# EAGLE schematic Teensy_Board_Connectors (EAGLE 7.1.0)
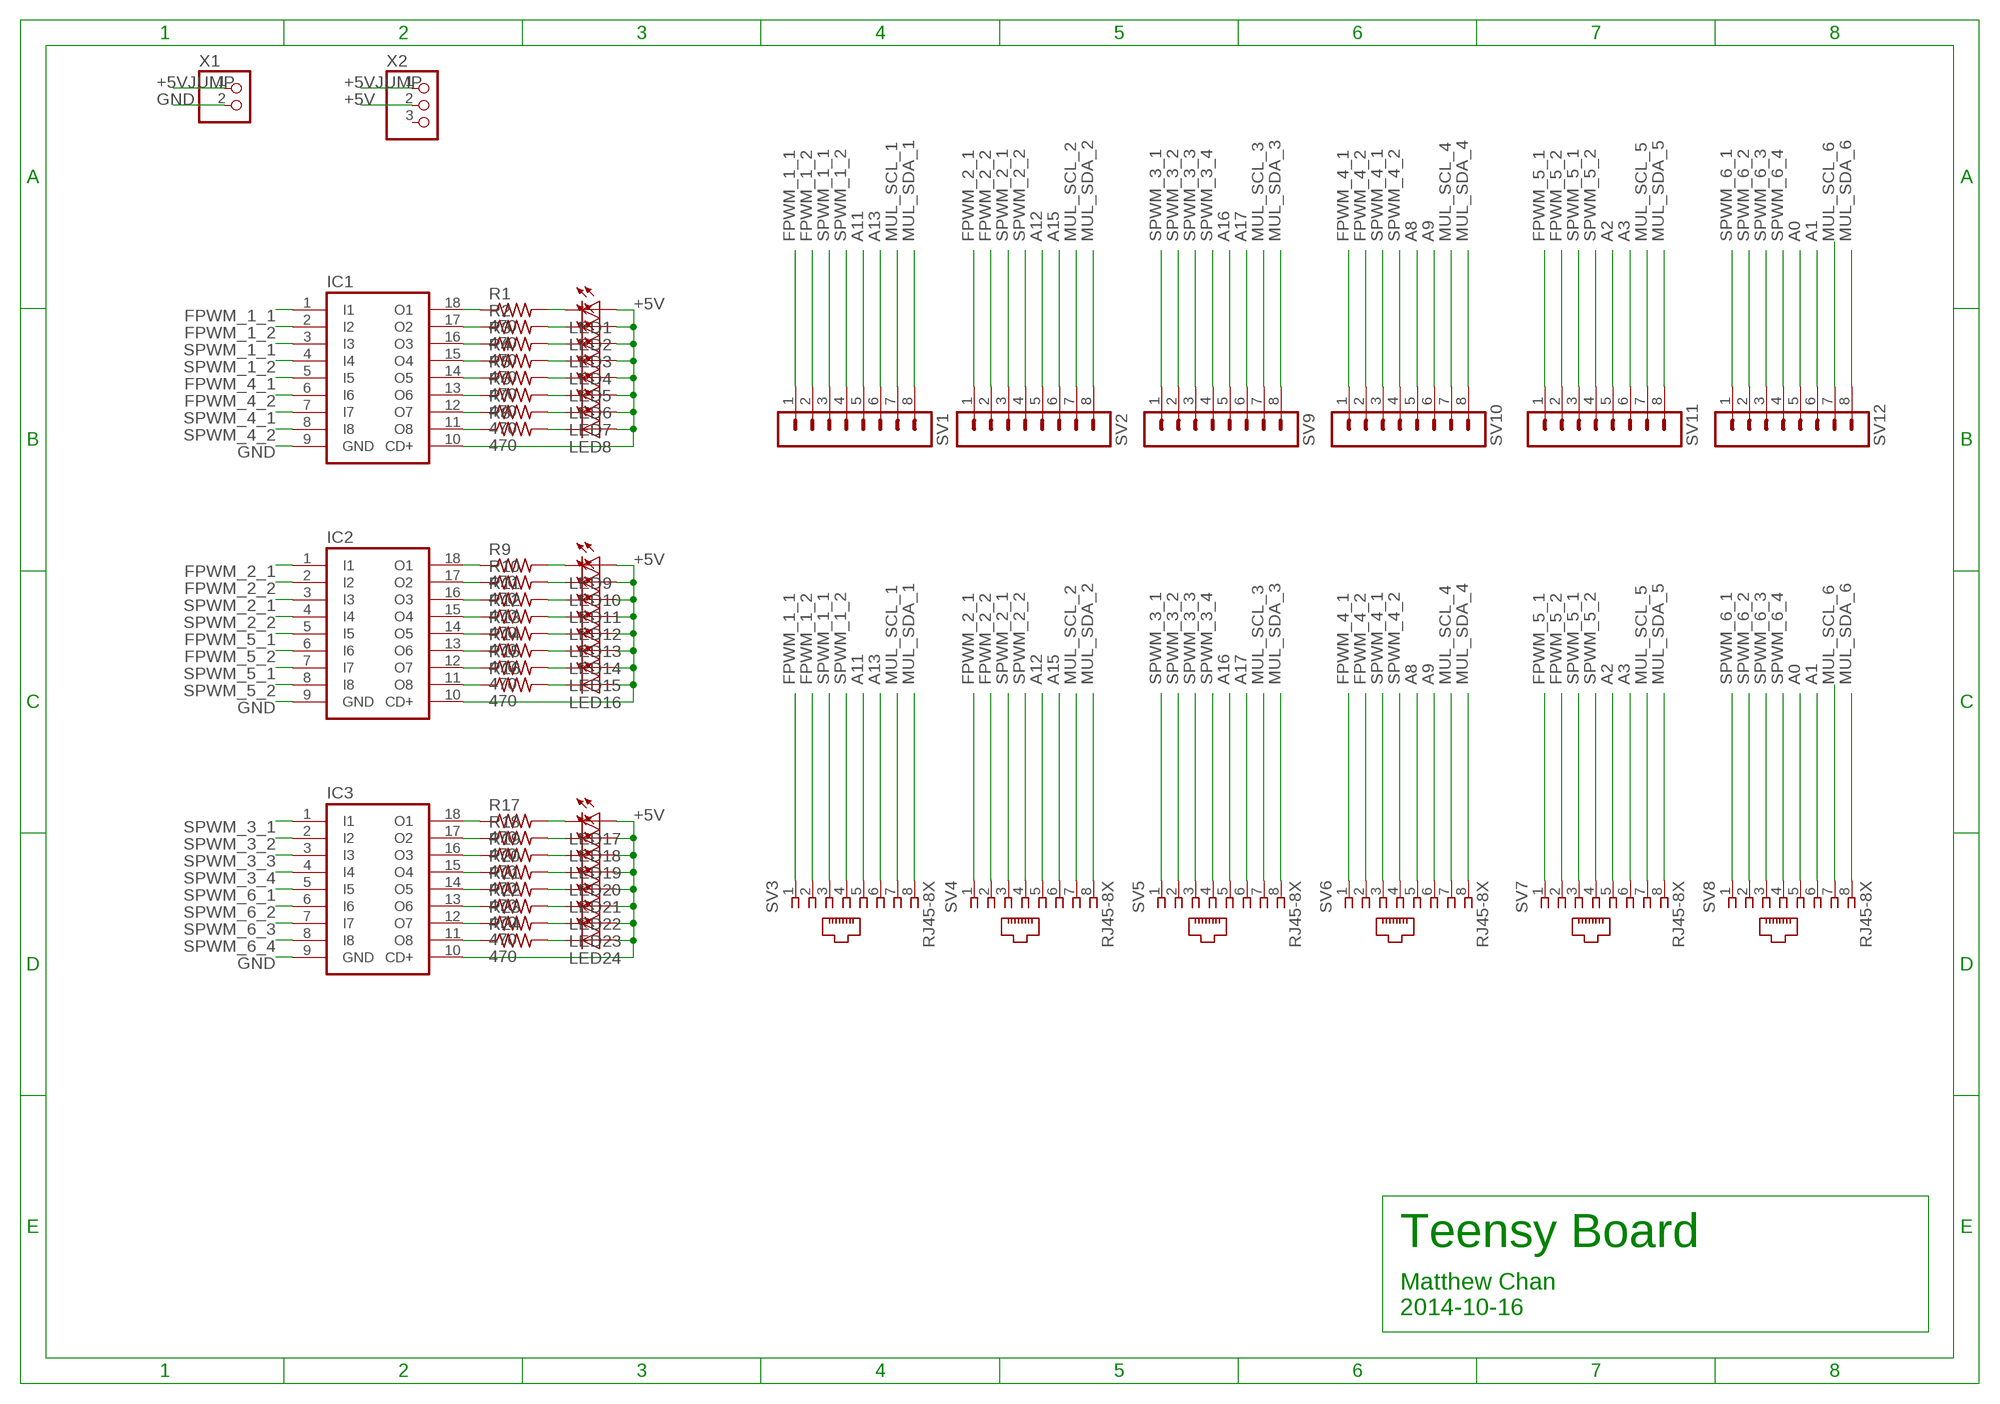
[diagram p0: schematic, sheet 1]

## Parts
IC1  ULN2803AFWG  [SOP18]
IC2  ULN2803AFWG  [SOP18]
IC3  ULN2803AFWG  [SOP18]
LED1  LEDSML1206  [SML1206]
LED2  LEDSML1206  [SML1206]
LED3  LEDSML1206  [SML1206]
LED4  LEDSML1206  [SML1206]
LED5  LEDSML1206  [SML1206]
LED6  LEDSML1206  [SML1206]
LED7  LEDSML1206  [SML1206]
LED8  LEDSML1206  [SML1206]
LED9  LEDSML1206  [SML1206]
LED10  LEDSML1206  [SML1206]
LED11  LEDSML1206  [SML1206]
LED12  LEDSML1206  [SML1206]
LED13  LEDSML1206  [SML1206]
LED14  LEDSML1206  [SML1206]
LED15  LEDSML1206  [SML1206]
LED16  LEDSML1206  [SML1206]
LED17  LEDSML1206  [SML1206]
LED18  LEDSML1206  [SML1206]
LED19  LEDSML1206  [SML1206]
LED20  LEDSML1206  [SML1206]
LED21  LEDSML1206  [SML1206]
LED22  LEDSML1206  [SML1206]
LED23  LEDSML1206  [SML1206]
LED24  LEDSML1206  [SML1206]
R1  470  R-US_R0603  [R0603]
R2  470  R-US_R0603  [R0603]
R3  470  R-US_R0603  [R0603]
R4  470  R-US_R0603  [R0603]
R5  470  R-US_R0603  [R0603]
R6  470  R-US_R0603  [R0603]
R7  470  R-US_R0603  [R0603]
R8  470  R-US_R0603  [R0603]
R9  470  R-US_R0603  [R0603]
R10  470  R-US_R0603  [R0603]
R11  470  R-US_R0603  [R0603]
R12  470  R-US_R0603  [R0603]
R13  470  R-US_R0603  [R0603]
R14  470  R-US_R0603  [R0603]
R15  470  R-US_R0603  [R0603]
R16  470  R-US_R0603  [R0603]
R17  470  R-US_R0603  [R0603]
R18  470  R-US_R0603  [R0603]
R19  470  R-US_R0603  [R0603]
R20  470  R-US_R0603  [R0603]
R21  470  R-US_R0603  [R0603]
R22  470  R-US_R0603  [R0603]
R23  470  R-US_R0603  [R0603]
R24  470  R-US_R0603  [R0603]
SV1  MA08-1  [MA08-1]
SV2  MA08-1  [MA08-1]
SV3  RJ45-8X  [RJ45-NO-SHIELD]
SV4  RJ45-8X  [RJ45-NO-SHIELD]
SV5  RJ45-8X  [RJ45-NO-SHIELD]
SV6  RJ45-8X  [RJ45-NO-SHIELD]
SV7  RJ45-8X  [RJ45-NO-SHIELD]
SV8  RJ45-8X  [RJ45-NO-SHIELD]
SV9  MA08-1  [MA08-1]
SV10  MA08-1  [MA08-1]
SV11  MA08-1  [MA08-1]
SV12  MA08-1  [MA08-1]
X1  PINHD-1X2  [1X02]
X2  PINHD-1X3  [1X03]

## Nets
+5V: IC1.10(CD+) IC2.10(CD+) IC3.10(CD+) LED1.A LED2.A LED3.A LED4.A LED5.A LED6.A LED7.A LED8.A LED9.A LED10.A LED11.A LED12.A LED13.A LED14.A LED15.A LED16.A LED17.A LED18.A LED19.A LED20.A LED21.A LED22.A LED23.A LED24.A X2.2
+5VJUMP: X1.1 X2.1
A0: SV8.5 SV12.5
A1: SV8.6 SV12.6
A2: SV7.5 SV11.5
A3: SV7.6 SV11.6
A8: SV6.5 SV10.5
A9: SV6.6 SV10.6
A11: SV1.5 SV3.5
A12: SV2.5 SV4.5
A13: SV1.6 SV3.6
A15: SV2.6 SV4.6
A16: SV5.5 SV9.5
A17: SV5.6 SV9.6
FPWM_1_1: IC1.1(I1) SV1.1 SV3.1
FPWM_1_2: IC1.2(I2) SV1.2 SV3.2
FPWM_2_1: IC2.1(I1) SV2.1 SV4.1
FPWM_2_2: IC2.2(I2) SV2.2 SV4.2
FPWM_4_1: IC1.5(I5) SV6.1 SV10.1
FPWM_4_2: IC1.6(I6) SV6.2 SV10.2
FPWM_5_1: IC2.5(I5) SV7.1 SV11.1
FPWM_5_2: IC2.6(I6) SV7.2 SV11.2
GND: IC1.9(GND) IC2.9(GND) IC3.9(GND) X1.2
MUL_SCL_1: SV1.7 SV3.7
MUL_SCL_2: SV2.7 SV4.7
MUL_SCL_3: SV5.7 SV9.7
MUL_SCL_4: SV6.7 SV10.7
MUL_SCL_5: SV7.7 SV11.7
MUL_SCL_6: SV8.7 SV12.7
MUL_SDA_1: SV1.8 SV3.8
MUL_SDA_2: SV2.8 SV4.8
MUL_SDA_3: SV5.8 SV9.8
MUL_SDA_4: SV6.8 SV10.8
MUL_SDA_5: SV7.8 SV11.8
MUL_SDA_6: SV8.8 SV12.8
N$1: IC1.18(O1) R1.1
N$2: LED1.C R1.2
N$3: IC1.17(O2) R2.1
N$4: IC1.16(O3) R3.1
N$5: IC1.15(O4) R4.1
N$6: IC1.14(O5) R5.1
N$7: IC1.13(O6) R6.1
N$8: IC1.12(O7) R7.1
N$10: IC1.11(O8) R8.1
N$11: LED2.C R2.2
N$12: LED3.C R3.2
N$13: LED4.C R4.2
N$14: LED5.C R5.2
N$15: LED6.C R6.2
N$16: LED7.C R7.2
N$17: LED8.C R8.2
N$18: IC2.18(O1) R9.1
N$19: LED9.C R9.2
N$20: IC2.17(O2) R10.1
N$21: IC2.16(O3) R11.1
N$22: IC2.15(O4) R12.1
N$23: IC2.14(O5) R13.1
N$24: IC2.13(O6) R14.1
N$25: IC2.12(O7) R15.1
N$26: IC2.11(O8) R16.1
N$27: LED10.C R10.2
N$28: LED11.C R11.2
N$29: LED12.C R12.2
N$30: LED13.C R13.2
N$31: LED14.C R14.2
N$32: LED15.C R15.2
N$33: LED16.C R16.2
N$34: IC3.18(O1) R17.1
N$35: LED17.C R17.2
N$36: IC3.17(O2) R18.1
N$37: IC3.16(O3) R19.1
N$38: IC3.15(O4) R20.1
N$39: IC3.14(O5) R21.1
N$40: IC3.13(O6) R22.1
N$41: IC3.12(O7) R23.1
N$42: IC3.11(O8) R24.1
N$43: LED18.C R18.2
N$44: LED19.C R19.2
N$45: LED20.C R20.2
N$46: LED21.C R21.2
N$47: LED22.C R22.2
N$48: LED23.C R23.2
N$49: LED24.C R24.2
SPWM_1_1: IC1.3(I3) SV1.3 SV3.3
SPWM_1_2: IC1.4(I4) SV1.4 SV3.4
SPWM_2_1: IC2.3(I3) SV2.3 SV4.3
SPWM_2_2: IC2.4(I4) SV2.4 SV4.4
SPWM_3_1: IC3.1(I1) SV5.1 SV9.1
SPWM_3_2: IC3.2(I2) SV5.2 SV9.2
SPWM_3_3: IC3.3(I3) SV5.3 SV9.3
SPWM_3_4: IC3.4(I4) SV5.4 SV9.4
SPWM_4_1: IC1.7(I7) SV6.3 SV10.3
SPWM_4_2: IC1.8(I8) SV6.4 SV10.4
SPWM_5_1: IC2.7(I7) SV7.3 SV11.3
SPWM_5_2: IC2.8(I8) SV7.4 SV11.4
SPWM_6_1: IC3.5(I5) SV8.1 SV12.1
SPWM_6_2: IC3.6(I6) SV8.2 SV12.2
SPWM_6_3: IC3.7(I7) SV8.3 SV12.3
SPWM_6_4: IC3.8(I8) SV8.4 SV12.4
Unconnected: X2.3

## Notes on the sheet
- Teensy Board
- Matthew Chan
  2014-10-16

## Library data of the parts
IC1-IC3 = CBLA_Test_bed_Library:ULN2803A: DRIVER ARRAY
LED1-LED24 = led:LED: LED OSRAM: - CHIPLED LG R971, LG N971, LY N971, LG Q971, LY Q971, LO R971, LY R971 LH N974, LH R974 LS Q976, LO Q976, LY Q976 LO Q996 - Hyper CHIPLED LW Q18S LB Q993, LB Q99A, LB R99A - SideLED LS A670, LO A670, LY A670, LG A670, LP A670 LB A673, LV A673, LT A673, LW A673 LH A674 LY A675 LS A676, LA A676, LO A676, LY A676, LW A676 LS A679, LY A679, LG A679 - Hyper Micro SIDELED® LS Y876, LA Y876, LO Y876, LY Y876 LT Y87S - SmartLED LW L88C, LW L88S LB L89C, LB L89S, LG L890 LS L89K, LO L89K, LY L89K LS L896, LA L896, LO L896, LY L896 - TOPLED LS T670, LO T670, LY T670, LG T670, LP T670 LSG T670, LSP T670, LSY T670, LOP T670, LYG T670 LG T671, LOG T671, LSG T671 LB T673, LV T673, LT T673, LW T673 LH T674 LS T676, LA T676, LO T676, LY T676, LB T676, LH T676, LSB T676, LW T676 LB T67C, LV T67C, LT T67C, LS T67K, LO T67K, LY T67K, LW E67C LS E67B, LA E67B, LO E67B, LY E67B, LB E67C, LV E67C, LT E67C LW T67C LS T679, LY T679, LG T679 LS T770, LO T770, LY T770, LG T770, LP T770 LB T773, LV T773, LT T773, LW T773 LH T774 LS E675, LA E675, LY E675, LS T675 LS T776, LA T776, LO T776, LY T776, LB T776 LHGB T686 LT T68C, LB T68C - Hyper Mini TOPLED® LB M676 - Mini TOPLED Santana® LG M470 LS M47K, LO M47K, LY M47K Source: http://www.osram.convergy.de LUXEON: - LUMILED® LXK2-PW12-R00, LXK2-PW12-S00, LXK2-PW14-U00, LXK2-PW14-V00 LXK2-PM12-R00, LXK2-PM12-S00, LXK2-PM14-U00 LXK2-PE12-Q00, LXK2-PE12-R00, LXK2-PE12-S00, LXK2-PE14-T00, LXK2-PE14-U00 LXK2-PB12-K00, LXK2-PB12-L00, LXK2-PB12-M00, LXK2-PB14-N00, LXK2-PB14-P00, LXK2-PB14-Q00 LXK2-PR12-L00, LXK2-PR12-M00, LXK2-PR14-Q00, LXK2-PR14-R00 LXK2-PD12-Q00, LXK2-PD12-R00, LXK2-PD12-S00 LXK2-PH12-R00, LXK2-PH12-S00 LXK2-PL12-P00, LXK2-PL12-Q00, LXK2-PL12-R00 Source: www.luxeon.com KINGBRIGHT: KA-3528ASYC Source: www.kingbright.com
R1-R24 = CBLA_Test_bed_Library:R-US_: RESISTOR, American symbol
SV1 SV2 SV9-SV12 = con-lstb:MA08-1: PIN HEADER; OC_FARNELL: unknown; OC_NEWARK: unknown
SV3-SV8 = CBLA_Test_bed_Library:RJ45: CORCOM Modular RJ Jacks No Shield Source: www.tycoelectronics.com .. ENG_DS_1654001_1099_RJ_L_0507.pdf; MPN: RJ45-8X; OC_FARNELL: unknown; OC_NEWARK: 16R6101
X1 = CBLA_Test_bed_Library:PINHD-1X2: PIN HEADER
X2 = CBLA_Test_bed_Library:PINHD-1X3: PIN HEADER